# EAGLE design Esquema (EAGLE 9.6.2)
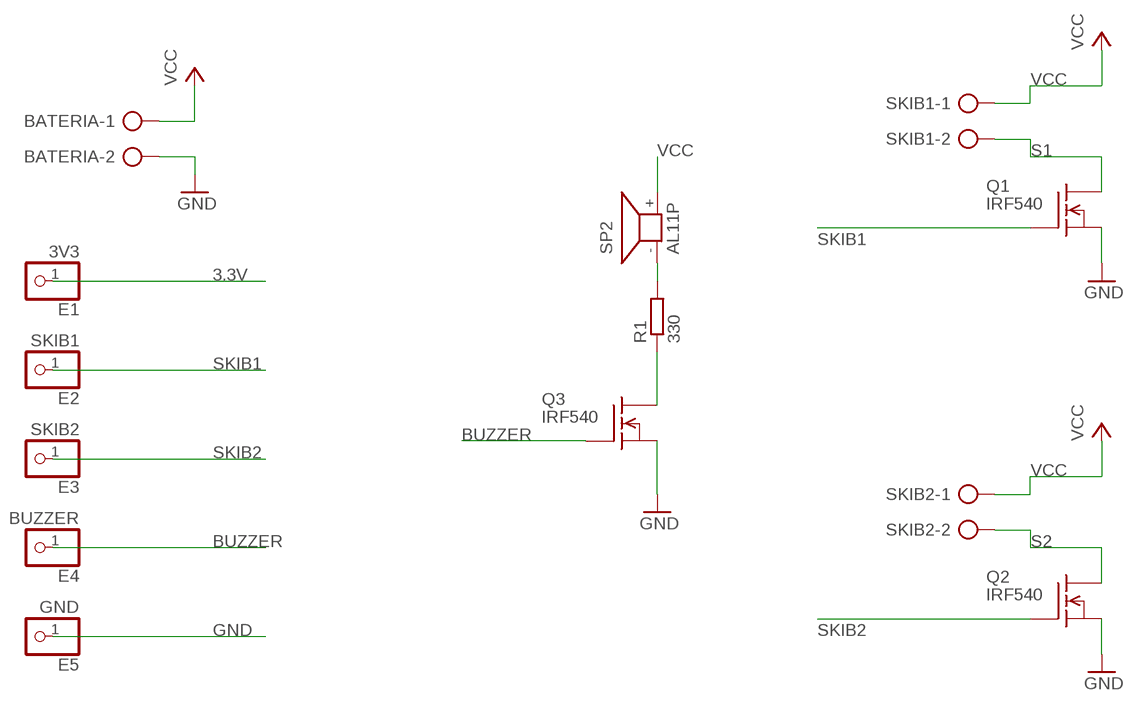
[diagram p0: schematic, sheet 1]

## Parts
BATERIA  AK500/2-H  [AK500/2-H]
E1  3V3  PINHD-1X1  [1X01]
E2  SKIB1  PINHD-1X1  [1X01]
E3  SKIB2  PINHD-1X1  [1X01]
E4  BUZZER  PINHD-1X1  [1X01]
E5  GND  PINHD-1X1  [1X01]
Q1  IRF540  [TO220]
Q2  IRF540  [TO220]
Q3  IRF540  [TO220]
R1  330  R-EU_0207/10  [0207/10]
SKIB1  AK500/2-H  [AK500/2-H]
SKIB2  AK500/2-H  [AK500/2-H]
SP2  AL11P  [AL11P]

## Nets
3.3V: E1.1
BUZZER: E4.1 Q3.1(G)
GND: BATERIA.2 E5.1 Q1.3(S) Q2.3(S) Q3.3(S)
N$2: Q3.2(D) R1.1
N$4: R1.2 SP2.-
S1: Q1.2(D) SKIB1.2
S2: Q2.2(D) SKIB2.2
SKIB1: E2.1 Q1.1(G)
SKIB2: E3.1 Q2.1(G)
VCC: BATERIA.1 SKIB1.1 SKIB2.1 SP2.+

## Library data of the parts
BATERIA SKIB1 SKIB2 = con-ptr500:AK500/2-H: CONNECTOR Aug. 2004 / PTR Meßtechnik: Die Bezeichnung der Serie AK505 wurde geändert. Es handelt sich hierbei um AK500 in horizontaler Ausführung.; OC_FARNELL: unknown; OC_NEWARK: unknown
E1-E5 = pinhead:PINHD-1X1: PIN HEADER
Q1-Q3 = transistor-fet:IRF540: N-Channel Enhancement MOSFET (HEXFET); 100V; 28A; 0,077Ohm
R1 = rcl:R-EU_: RESISTOR, European symbol; SPICEPREFIX: R
SP2 = buzzer:AL11P: SPEAKER Source: Buerklin; OC_FARNELL: unknown; OC_NEWARK: unknown

## Board
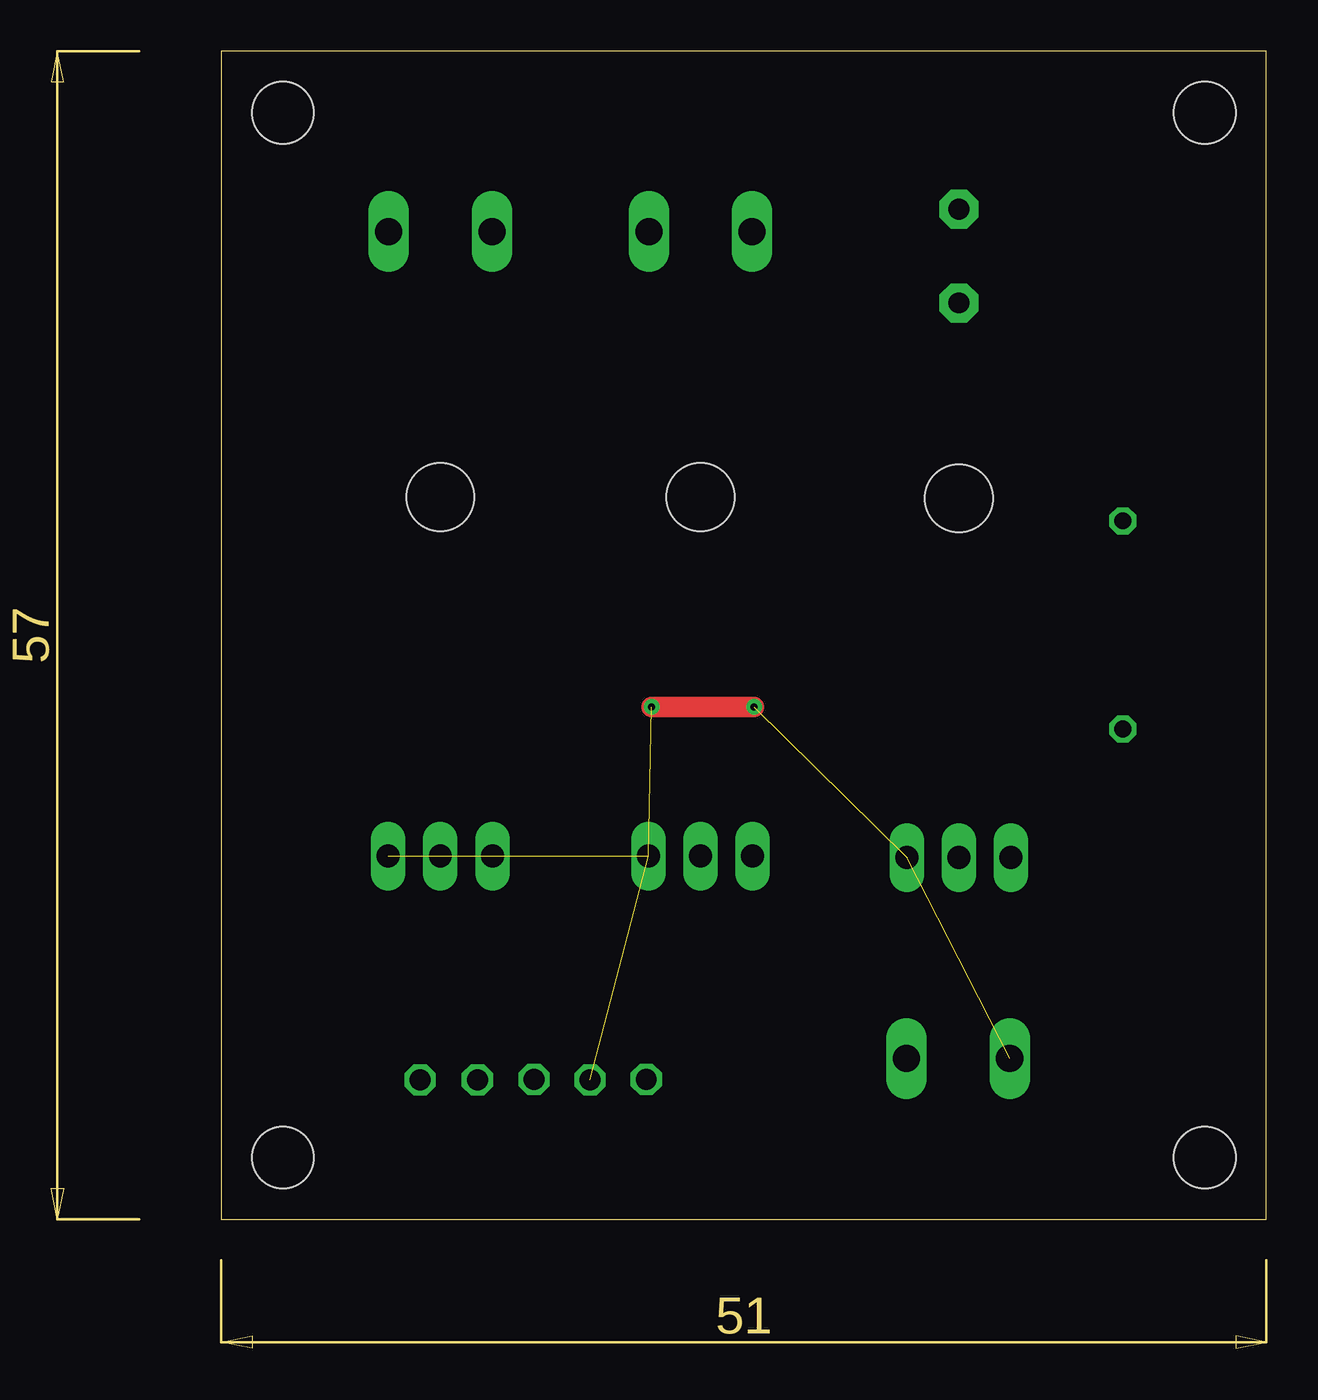
[diagram p1: board, top side]
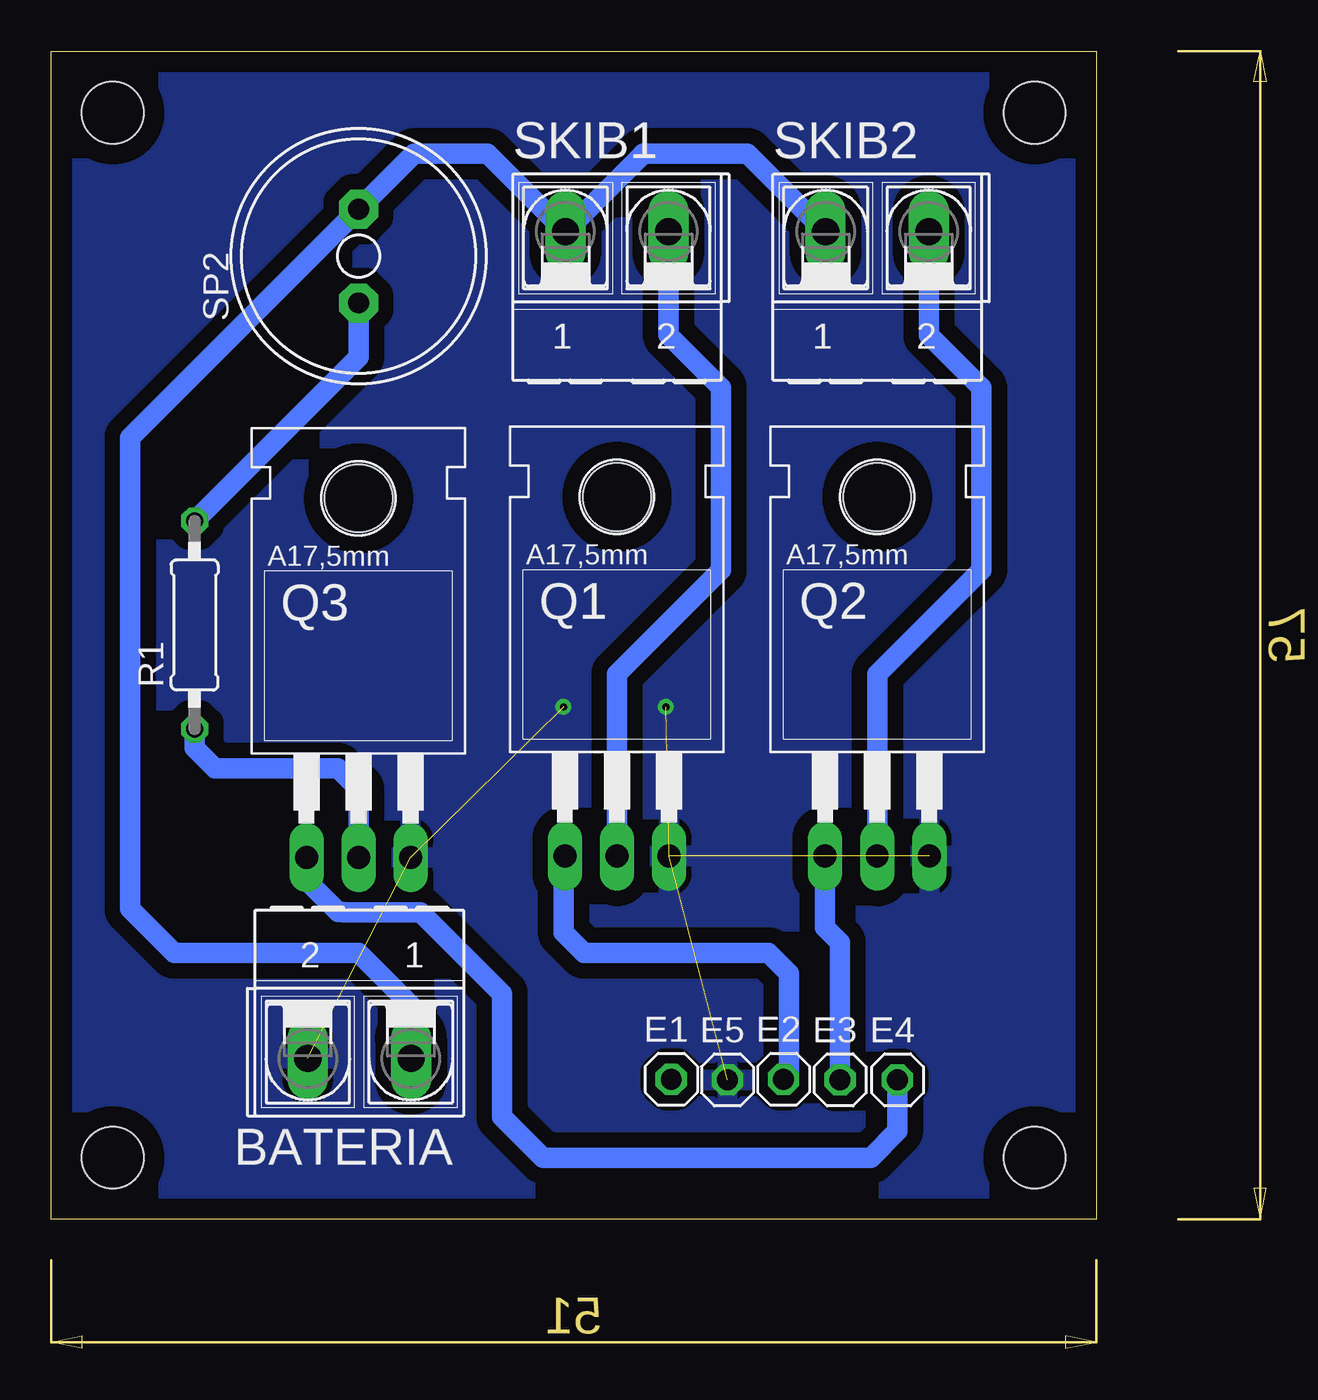
[diagram p2: board, bottom side, seen from below]

Size 51 x 57 mm. Coordinates in mm from the lower left corner, seen from the top.
Outline: 0,0 51,0 51,57 0,57 0,0
Copper layers (1*16): Top 0.035mm / dielectric 1.5mm / Bottom 0.035mm
Design rules "default *": minimum track width 1mm, minimum drill 0.35mm, track to track 30mil, track to pad 0.5mm, pad to pad 6mil, via to via 6mil, smd to smd 6mil, copper to edge 40mil, drill to drill 6mil, minimum pad ring 10mil, minimum via ring 8mil, stop-mask expansion 4mil, vias tented up to drill 0mil, thermal gap 10mil
Holes 3 mm at 48,54 3,54 48,3 3,3

### Footprints (pad centres in the part's own frame; a part is rotated, then mirrored left to right if it is on the bottom)
AK500/2-H = drill 1.321 long: 1 -2.515,0; 2 2.515,0
1X01 = drill 1.016 octagon: 1 0,0
TO220 = drill 1.118 long: 1 -2.54,-6.35; 2 0,-6.35; 3 2.54,-6.35 | hole 3.302: 0,11.176
0207/10 = drill 0.813 octagon: 1 -5.08,0; 2 5.08,0
AL11P = drill 1.016 pad 1.905 octagon: + 2.286,0; - -2.286,0

### Placement (x,y rotation side)
BATERIA  35.96,7.84 180 bottom
E1  20.74,6.83 0 bottom
E2  15.26,6.83 0 bottom
E3  12.5,6.8 0 bottom
E4  9.7,6.8 0 bottom
E5  18,6.8 0 bottom
Q1  23.39,24.07 0 bottom
Q2  10.69,24.07 0 bottom
Q3  36,24 0 bottom
R1  44,29 90 bottom
SKIB1  23.39,48.2 0 bottom
SKIB2  10.69,48.2 0 bottom
SP2  36,47 90 bottom

### Tracks (layer width: path | path; a pad name or v marks a point on that pad's centre or on a via)
BUZZER
  Bottom 1: E4.1 9.7,4.3 11,3 27,3 29,5 29,11 32.97,14.97 36.76,14.97 36.79,15 37,15 38.54,16.54 Q3.1
GND  (via drill 0.35)  (5 unrouted)
  Top 1: v26,25 v21,25
  pour Bottom: 50.06,56.09 50.06,0.94 1.05,0.94 1.05,56.09
N$2
  Bottom 1: Q3.2 36,21 37,22 43,22 44,23 R1.1
N$4
  Bottom 1: SP2.- 36,42.08 R1.2
S1
  Bottom 1: Q1.2 23.39,26.61 18.31,31.69 18.31,40.58 20.88,43.15 SKIB1.2
S2
  Bottom 1: Q2.2 10.69,26.61 5.61,31.69 5.61,40.58 8.18,43.15 SKIB2.2
SKIB1
  Bottom 1: E2.1 15,7.09 15,12 16,13 25,13 26,14 26,17.65 Q1.1
SKIB2
  Bottom 1: E3.1 12.5,13.5 13.23,14.23 Q2.1
VCC
  Bottom 1: SKIB2.1 17.02,52.01 22.12,52.01 22.12,51.98 SKIB1.1 29.7,52 33.29,52 SP2.+ 47.14,38.14 47.14,15.14 45,13 36,13 33.45,10.45 BATERIA.1